# EAGLE design tick-mk-5.0.1 (EAGLE 6.5.0)
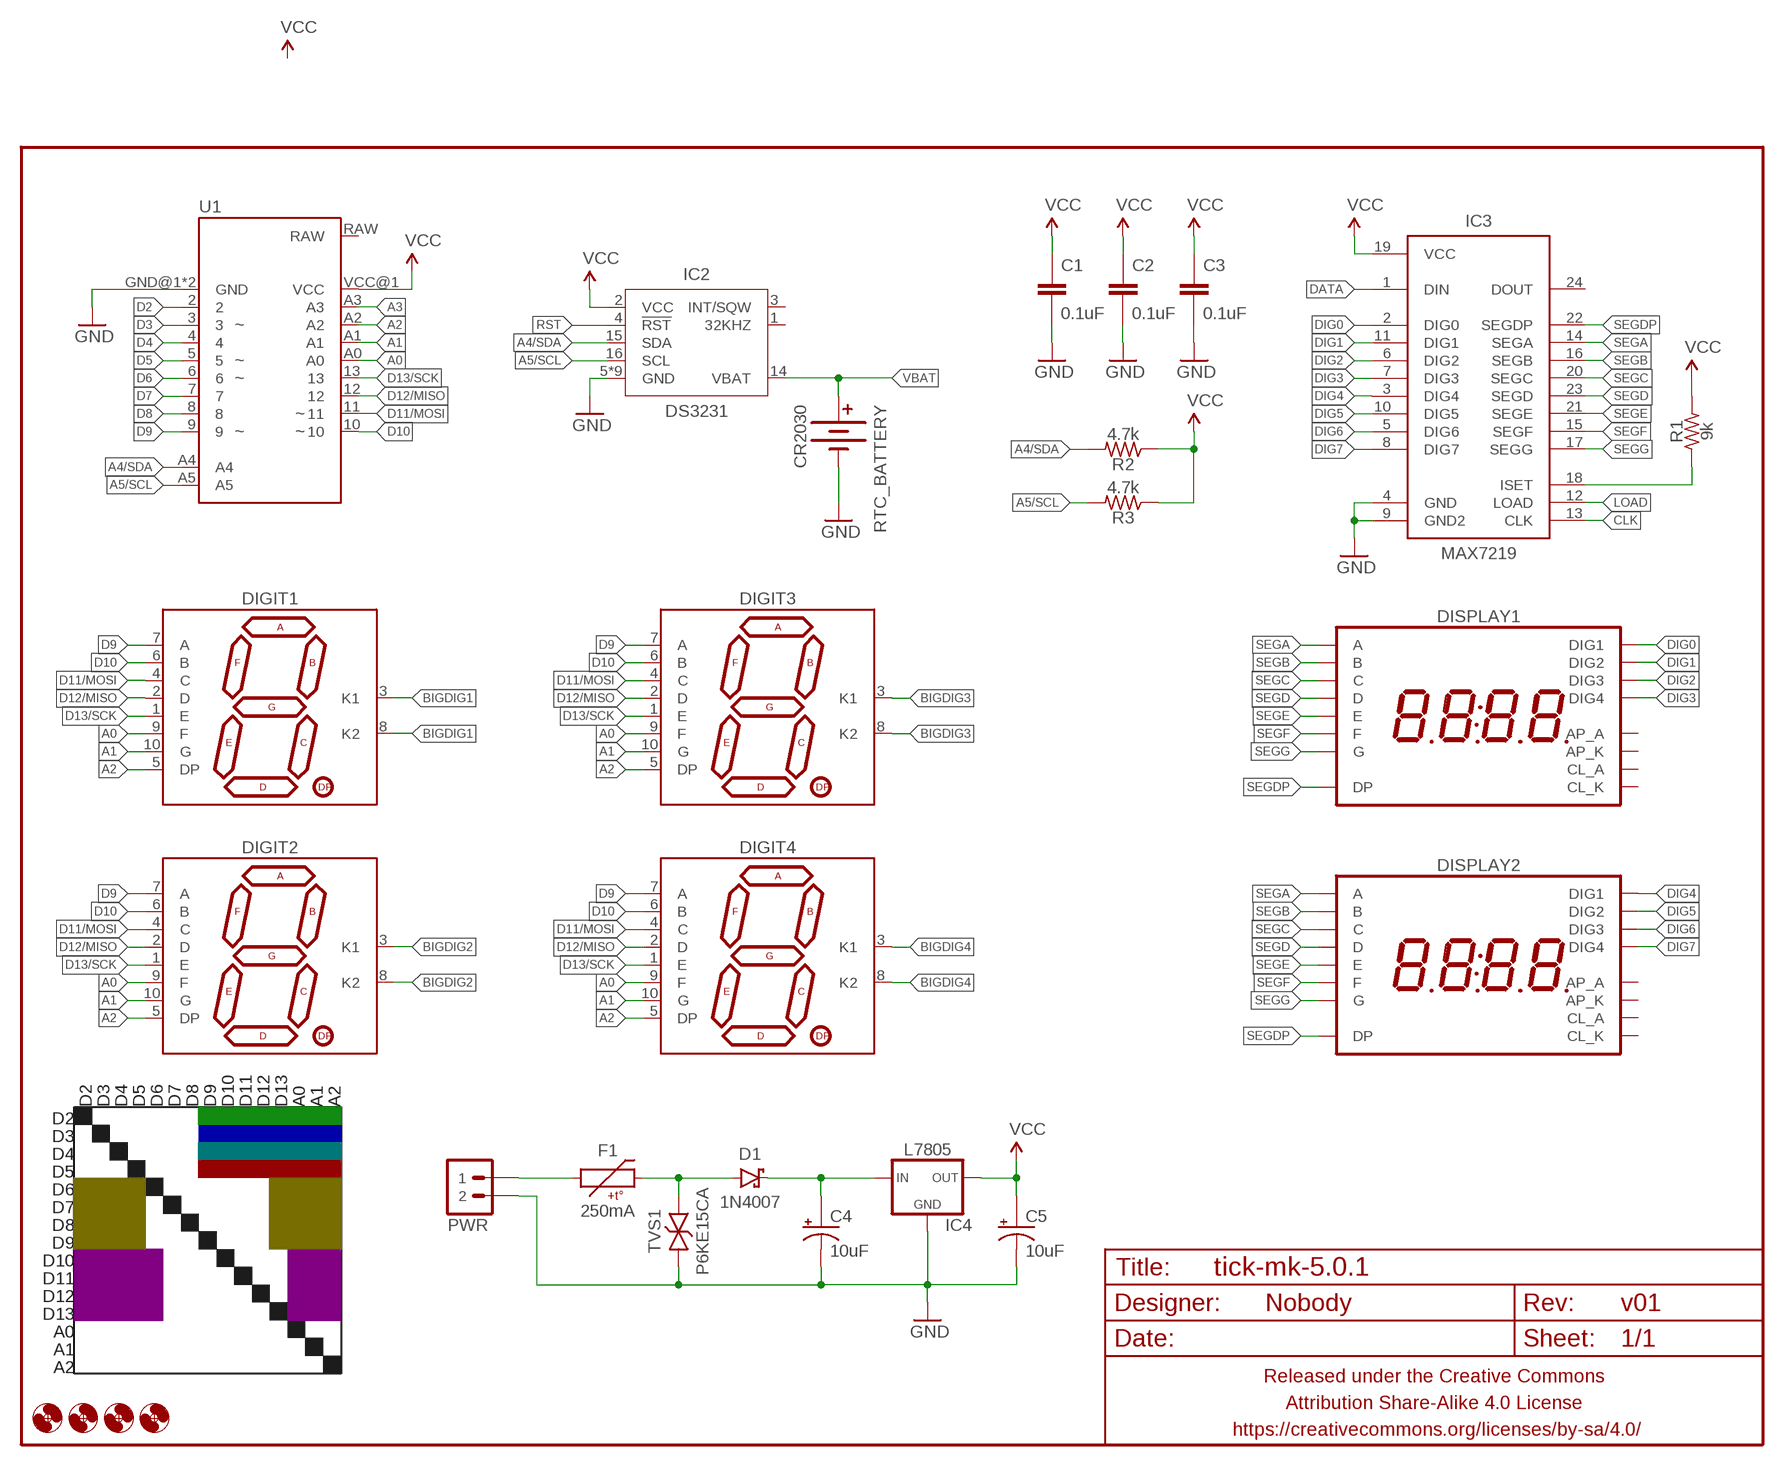
[diagram p0: schematic, sheet 1]

## Parts
C1  0.1uF  CAPACITOR-CERAMIC025-024X044  [C025-024X044]
C2  0.1uF  CAPACITOR-CERAMIC025-024X044  [C025-024X044]
C3  0.1uF  CAPACITOR-CERAMICC0603  [C0603]
C4  10uF  CAPACITOR-POLARIZEDE2-5  [E2-5]
C5  10uF  CAPACITOR-POLARIZEDE2-5  [E2-5]
D1  1N4007  DIODE-SCHOTTKYPTH-10.16MM  [DIODE-10.16MM]
DIGIT1  7SEG_1DIGPTH-25.4MM-BARE  [7SEG_1DIG_25.4MM_NOSILK]
DIGIT2  7SEG_1DIGPTH-25.4MM-BARE  [7SEG_1DIG_25.4MM_NOSILK]
DIGIT3  7SEG_1DIGPTH-25.4MM-BARE  [7SEG_1DIG_25.4MM_NOSILK]
DIGIT4  7SEG_1DIGPTH-25.4MM-BARE  [7SEG_1DIG_25.4MM_NOSILK]
DISPLAY1  7SEG_4DIGIT_COLON_APOS  [7SEG_4DIG_10MM]
DISPLAY2  7SEG_4DIGIT_COLON_APOS  [7SEG_4DIG_10MM]
F1  250mA  PTCPTH-5.08MM  [PTC-PTH-5.08MM]
FRAME1  FRAME-LETTERNO_PACKAGE  [DUMMY]
H1  HOLE2,5  [2,5]
H2  HOLE2,5  [2,5]
H3  HOLE2,5  [2,5]
H4  HOLE2,5  [2,5]
IC2  DS3231  [SO16W]
IC3  MAX7219  MAX7219SOIC-W  [SO24W]
IC4  L7805  V_REG_78XXTO-220-THERMPAD  [TO220-IGO-THERMPAD]
PWR  M02JST-PTH-RA-L+  [JST-2-PH-RA-PTH-L+]
R1  9k  RESISTORR0603  [R0603]
R2  4.7k  RESISTORPTH-AXIAL-6.35MM  [RESISTOR-AXIAL-PTH-6.35MM]
R3  4.7k  RESISTORPTH-AXIAL-6.35MM  [RESISTOR-AXIAL-PTH-6.35MM]
RTC_BATTERY  CR2030  BATTERY20MM_SMD_TIGHT  [BATTCON_20MM_MINE_STAHPIT]
TVS1  P6KE15CA  TVSDO-41-10.16MM  [DO-41-TVS-BI-10.16MM]
U1  ARDUINO_PRO_MINI_TICK2  [ARDUINO_PRO_MINI_TICK2]

## Nets
A0: DIGIT1.9(F) DIGIT2.9(F) DIGIT3.9(F) DIGIT4.9(F) U1.A0
A1: DIGIT1.10(G) DIGIT2.10(G) DIGIT3.10(G) DIGIT4.10(G) U1.A1
A2: DIGIT1.5(DP) DIGIT2.5(DP) DIGIT3.5(DP) DIGIT4.5(DP) U1.A2
A3: U1.A3
A4/SDA: IC2.15(SDA) R2.P$2 U1.A4
A5/SCL: IC2.16(SCL) R3.P$2 U1.A5
BIGDIG1: DIGIT1.3(K1) DIGIT1.8(K2)
BIGDIG2: DIGIT2.3(K1) DIGIT2.8(K2)
BIGDIG3: DIGIT3.3(K1) DIGIT3.8(K2)
BIGDIG4: DIGIT4.3(K1) DIGIT4.8(K2)
CLK: IC3.13(CLK)
D2: U1.2
D3: U1.3
D4: U1.4
D5: U1.5
D6: U1.6
D7: U1.7
D8: U1.8
D9: DIGIT1.7(A) DIGIT2.7(A) DIGIT3.7(A) DIGIT4.7(A) U1.9
D10: DIGIT1.6(B) DIGIT2.6(B) DIGIT3.6(B) DIGIT4.6(B) U1.10
D11/MOSI: DIGIT1.4(C) DIGIT2.4(C) DIGIT3.4(C) DIGIT4.4(C) U1.11
D12/MISO: DIGIT1.2(D) DIGIT2.2(D) DIGIT3.2(D) DIGIT4.2(D) U1.12
D13/SCK: DIGIT1.1(E) DIGIT2.1(E) DIGIT3.1(E) DIGIT4.1(E) U1.13
DATA: IC3.1(DIN)
DIG0: DISPLAY1.1(DIG1) IC3.2(DIG0)
DIG1: DISPLAY1.2(DIG2) IC3.11(DIG1)
DIG2: DISPLAY1.6(DIG3) IC3.6(DIG2)
DIG3: DISPLAY1.8(DIG4) IC3.7(DIG3)
DIG4: DISPLAY2.1(DIG1) IC3.3(DIG4)
DIG5: DISPLAY2.2(DIG2) IC3.10(DIG5)
DIG6: DISPLAY2.6(DIG3) IC3.5(DIG6)
DIG7: DISPLAY2.8(DIG4) IC3.8(DIG7)
GND: C1.2 C2.2 C3.2 C4.- C5.- IC2.5(GND) IC2.6(GND) IC2.7(GND) IC2.8(GND) IC2.9(GND) IC2.10(GND) IC2.11(GND) IC2.12(GND) IC2.13(GND) IC3.4(GND) IC3.9(GND2) IC4.4(GND) IC4.GND PWR.2 RTC_BATTERY.BOTTOM(-) TVS1.P$1 U1.GND@1(GND) U1.GND@2(GND)
LOAD: IC3.12(LOAD)
N$4: D1.A F1.P$2 TVS1.P$2
N$5: IC3.18(ISET) R1.1
N$7: F1.P$1 PWR.1
N$8: C4.+ D1.C IC4.IN
RST: IC2.4(!RST)
SEGA: DISPLAY1.14(A) DISPLAY2.14(A) IC3.14(SEGA)
SEGB: DISPLAY1.16(B) DISPLAY2.16(B) IC3.16(SEGB)
SEGC: DISPLAY1.13(C) DISPLAY2.13(C) IC3.20(SEGC)
SEGD: DISPLAY1.3(D) DISPLAY2.3(D) IC3.23(SEGD)
SEGDP: DISPLAY1.7(DP) DISPLAY2.7(DP) IC3.22(SEGDP)
SEGE: DISPLAY1.5(E) DISPLAY2.5(E) IC3.21(SEGE)
SEGF: DISPLAY1.11(F) DISPLAY2.11(F) IC3.15(SEGF)
SEGG: DISPLAY1.15(G) DISPLAY2.15(G) IC3.17(SEGG)
VBAT: IC2.14(VBAT) RTC_BATTERY.TOP@1(+) RTC_BATTERY.TOP@2(+)
VCC: C1.1 C2.1 C3.1 C5.+ IC2.2(VCC) IC3.19(VCC) IC4.OUT R1.2 R2.P$1 R3.P$1 U1.VCC@1(VCC)
Unconnected: DISPLAY1.4(CL_A) DISPLAY1.9(AP_K) DISPLAY1.10(AP_A) DISPLAY1.12(CL_K) DISPLAY2.4(CL_A) DISPLAY2.9(AP_K) DISPLAY2.10(AP_A) DISPLAY2.12(CL_K) IC2.1(32KHZ) IC2.3(INT/SQW) IC3.24(DOUT) U1.RAW

## Notes on the sheet
- D2 | D3 | D4 | D5 | D6 | D7 | D8 | D9 | D10 | D11 | D12 | D13 | A0 | A1 | A2
- D2
- D3
- D4
- D5
- D6
- D7
- D8
- D9
- D10
- D11
- D12
- D13
- A0
- A1
- A2

## Library data of the parts
C1-C3 = A_butts:CAPACITOR-CERAMIC: CAPACITOR, European symbol
C4 C5 = A_butts:CAPACITOR-POLARIZED: POLARIZED CAPACITOR, American symbol
D1 = A_butts:DIODE-SCHOTTKY: Schottky diodes in SFE's production catalog BAT20J 1A 23V 0.62Vf RB751 120mA 40V 0.37Vf PMEG4005EJ 0.5A 40V 0.42Vf MBRA140 1A 40V 0.5Vf B340A 3A 40V SMA
DIGIT1-DIGIT4 = A_butts:7SEG_1DIG
DISPLAY1 DISPLAY2 = A_butts:7SEG_4DIGIT_COLON_APOS
F1 = A_butts:PTC: Resettable Fuse PTC Resettable Fuse. Spark Fun Electronics SKU : COM-08357
FRAME1 = A_butts:FRAME-LETTER: Schematic Frame Standard 8.5x11 US Letter frame; DESIGNER: Nobody; VERSION: v01
H1-H4 = A_butts:HOLE: MOUNTING HOLE with drill center marker
IC2 = A_butts:DS3231
IC3 = A_butts:MAX7219: 8-digit, 8-segment LED display driver, serial input
IC4 = A_butts:V_REG_78XX: Voltage Regulator Standard 7805 5V regulator. IGO (Input Ground Output). Spark Fun Electronics SKU : COM-00107
PWR = A_butts:M02: Standard 2-pin 0.1" header. Use with - straight break away headers ( PRT-00116) - right angle break away headers (PRT-00553) - swiss pins (PRT-00743) - machine pins (PRT-00117) - female headers (PRT-00115) Molex polarized connector foot print use with: PRT-08233 with associated crimp pins and housings. 2.54_SCREWTERM for use with PRT-10571. 3.5mm Screw Terminal footprints for PRT-08084 5mm Screw Terminal footprints for use with PRT-08433
R1-R3 = A_butts:RESISTOR: RESISTOR, American symbol
RTC_BATTERY = A_butts:BATTERY: Battery Holders Various common sizes : AA, AAA, 20mm coin cell and 12mm coin cell. 20MM_4LEGS, BATT-10373
TVS1 = A_butts:TVS: Transient voltage suppressor- prevents ESD on inputs. Ignore package description- MBRA140 is NOT this type of part!!!
U1 = A_butts:ARDUINO_PRO_MINI_TICK2

## Board
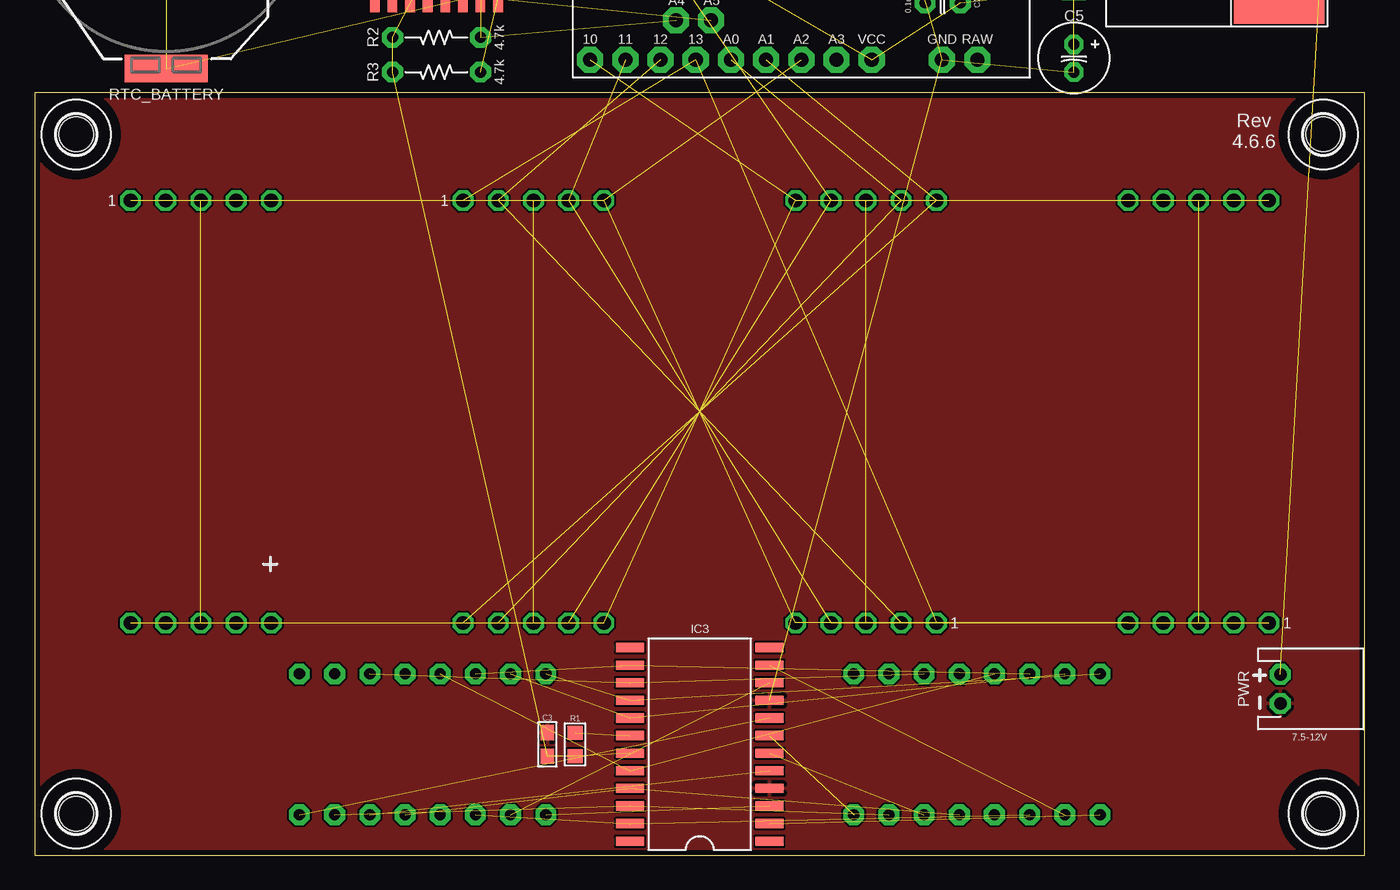
[diagram p1: board, top side]
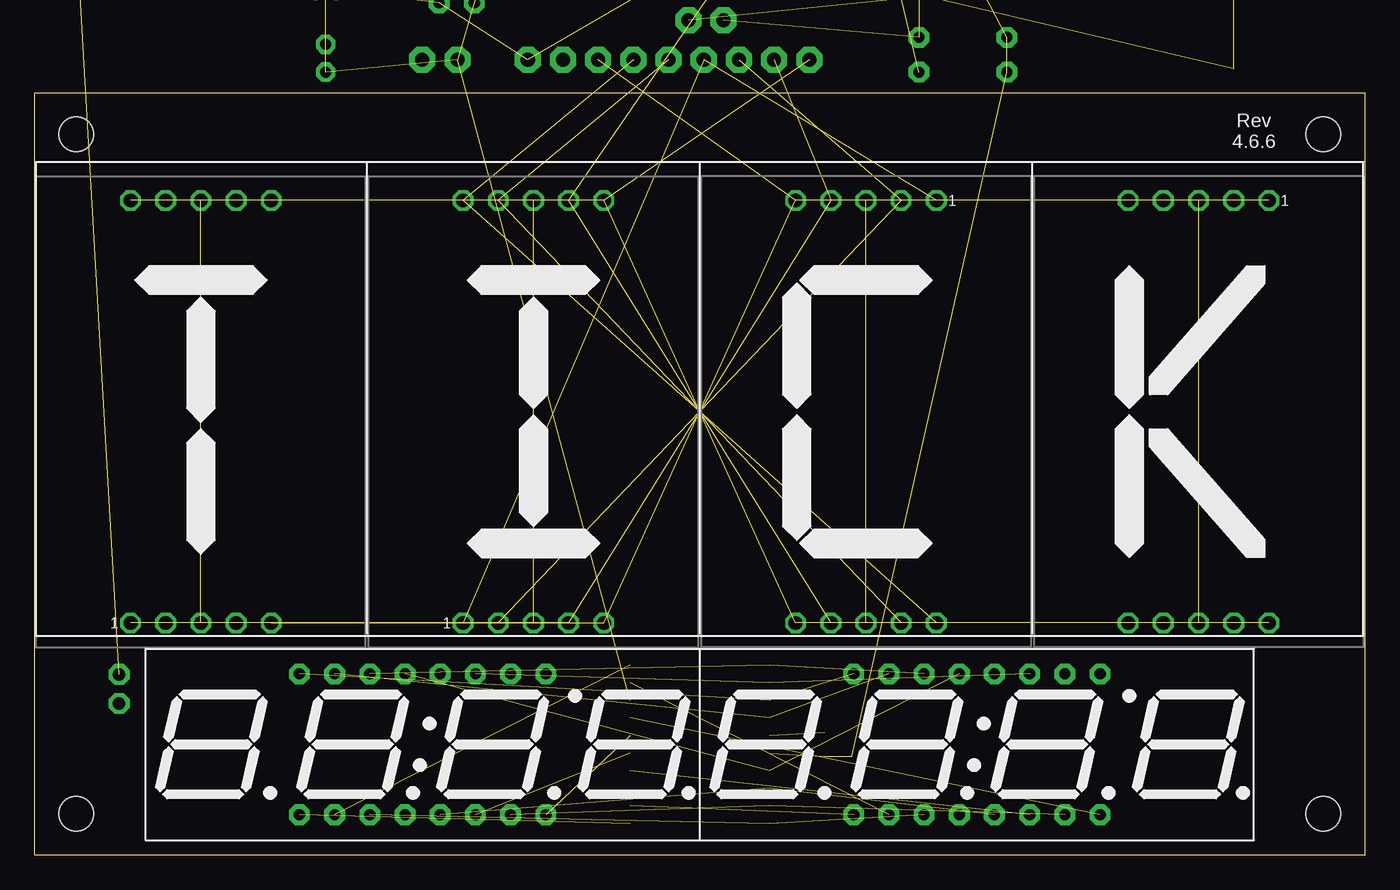
[diagram p2: board, bottom side, seen from below]

Size 96 x 55 mm. Coordinates in mm from the lower left corner, seen from the top.
Outline: 0,55 0,0 96,0 96,55 0,55
Copper layers (1*16): Top 0.0356mm / dielectric 1.5011mm / Bottom 0.0356mm
Design rules "LaenPCBOrder_2": minimum track width 6mil, minimum drill 13mil, track to track 6mil, track to pad 6mil, pad to pad 6mil, via to via 6mil, smd to smd 6mil, copper to edge 15mil, drill to drill 6mil, minimum pad ring 7mil, minimum via ring 7mil, stop-mask expansion 3mil, vias tented up to drill 20mil, thermal gap 10mil

### Footprints (pad centres in the part's own frame; a part is rotated, then mirrored left to right if it is on the bottom)
C025-024X044 = drill 0.813 pad 1.5 octagon: 1 -1.27,0; 2 1.27,0
C0603 = smd 1.1 x 1: 1 -0.85,0; 2 0.85,0
E2-5 = drill 0.8 pad 1.4 octagon: + -1,0; - 1,0
DIODE-10.16MM = drill 1.1 pad 1.778: A -5.08,0; C 5.08,0
7SEG_1DIG_25.4MM_NOSILK = drill 1 pad 1.5 octagon: 1 -5.08,-15.24; 2 -2.54,-15.24; 3 0,-15.24; 4 2.54,-15.24; 5 5.08,-15.24; 6 5.08,15.24; 7 2.54,15.24; 8 0,15.24; 9 -2.54,15.24; 10 -5.08,15.24
7SEG_4DIG_10MM = drill 0.8 pad 1.5 octagon: 1 -8.89,-5.08; 2 -6.35,-5.08; 3 -3.81,-5.08; 4 -1.27,-5.08; 5 1.27,-5.08; 6 3.81,-5.08; 7 6.35,-5.08; 8 8.89,-5.08; 9 8.89,5.08; 10 6.35,5.08; 11 3.81,5.08; 12 1.27,5.08; 13 -1.27,5.08; 14 -3.81,5.08; 15 -6.35,5.08; 16 -8.89,5.08
PTC-PTH-5.08MM = drill 0.9 pad 1.5 octagon: P$1 -2.54,0; P$2 2.54,0
2,5 = hole 2.5: 0,0
SO16W = smd 0.7 x 2: 1 -4.445,-4.685; 2 -3.175,-4.685; 3 -1.905,-4.685; 4 -0.635,-4.685; 5 0.635,-4.685; 6 1.905,-4.685; 7 3.175,-4.685; 8 4.445,-4.685; 9 4.445,4.685; 10 3.175,4.685; 11 1.905,4.685; 12 0.635,4.685; 13 -0.635,4.685; 14 -1.905,4.685; 15 -3.175,4.685; 16 -4.445,4.685
SO24W = smd 0.66 x 2.032: 1 -6.985,-5.029; 2 -5.715,-5.029; 3 -4.445,-5.029; 4 -3.175,-5.029; 5 -1.905,-5.029; 6 -0.635,-5.029; 7 0.635,-5.029; 8 1.905,-5.029; 9 3.175,-5.029; 10 4.445,-5.029; 11 5.715,-5.029; 12 6.985,-5.029; 13 6.985,5.029; 14 5.715,5.029; 15 4.445,5.029; 16 3.175,5.029; 17 1.905,5.029; 18 0.635,5.029; 19 -0.635,5.029; 20 -1.905,5.029; 21 -3.175,5.029; 22 -4.445,5.029; 23 -5.715,5.029; 24 -6.985,5.029
TO220-IGO-THERMPAD = smd 10 x 6.5: 4 0,11 | drill 1 long: GND 0,-3.81; IN -2.54,-3.81; OUT 2.54,-3.81
JST-2-PH-RA-PTH-L+ = drill 0.9 pad 1.5 octagon: 1 -1.05,0; 2 1.05,0
R0603 = smd 1 x 1.1: 1 -0.85,0; 2 0.85,0
RESISTOR-AXIAL-PTH-6.35MM = drill 0.8 pad 1.5 octagon: P$1 -3.175,0; P$2 3.175,0
BATTCON_20MM_MINE_STAHPIT = smd 10 x 10: BOTTOM 0,0 | smd 6 x 2: TOP@1 0,11.25; TOP@2 0,-11.25
DO-41-TVS-BI-10.16MM = drill 1.1 pad 1.778: P$1 -5.08,0; P$2 5.08,0
ARDUINO_PRO_MINI_TICK2 = drill 1.016 pad 1.88 octagon: 2 -7.62,2.54; 3 -7.62,0; 4 -7.62,-2.54; 5 -7.62,-5.08; 6 -7.62,-7.62; 7 -7.62,-10.16; 8 -7.62,-12.7; 9 -7.62,-15.24; 10 7.62,-15.24; 11 7.62,-12.7; 12 7.62,-10.16; 13 7.62,-7.62; A0 7.62,-5.08; A1 7.62,-2.54; A2 7.62,0; A3 7.62,2.54; A4 4.763,-9.049; A5 4.763,-6.509; GND@1 -7.62,5.08; GND@2 7.62,10.16; RAW 7.62,12.7; VCC@1 7.62,5.08

### Placement (x,y rotation side)
C1  65.54,61.5 180 top  (outside the outline)
C2  36.5,70 270 top  (outside the outline)
C3  37,8 90 top
C4  75,72.5 90 top  (outside the outline)
C5  75,57.5 270 top
D1  84,76 180 top  (outside the outline)
DIGIT1  84,32 0 bottom
DIGIT2  60,32 0 bottom
DIGIT3  36,32 180 bottom
DIGIT4  12,32 180 bottom
DISPLAY1  68,8 0 bottom
DISPLAY2  28,8 0 bottom
F1  93.5,78.5 90 top  (outside the outline)
FRAME1  0,-13 0 top  (outside the outline)
H1  3,3 0 top
H2  93,3 0 top
H3  93,52 0 top
H4  3,52 0 top
IC2  29,66.5 180 top  (outside the outline)
IC3  48,8 90 top
IC4  78.81,65 270 top  (outside the outline)
PWR  89.9,12 270 top
R1  39,8 270 top
R2  29,59 0 top  (outside the outline)
R3  29,56.5 0 top
RTC_BATTERY  9.5,68 180 top
TVS1  84,81 0 top  (outside the outline)
U1  55.33,65 270 top
U$1  [TICK_SYMBOL]  48,32 0 bottom

### Tracks (layer width: path | path; a pad name or v marks a point on that pad's centre or on a via)
A0  (4 unrouted)
A1  (4 unrouted)
A2  (4 unrouted)
A4/SDA  (2 unrouted)
A5/SCL  (2 unrouted)
BIGDIG1  (1 unrouted)
BIGDIG2  (1 unrouted)
BIGDIG3  (1 unrouted)
BIGDIG4  (1 unrouted)
D9  (4 unrouted)
D10  (4 unrouted)
D11/MOSI  (4 unrouted)
D12/MISO  (4 unrouted)
D13/SCK  (4 unrouted)
DIG0  (1 unrouted)
DIG1  (1 unrouted)
DIG2  (1 unrouted)
DIG3  (1 unrouted)
DIG4  (1 unrouted)
DIG5  (1 unrouted)
DIG6  (1 unrouted)
DIG7  (1 unrouted)
GND  (19 unrouted)
  pour Top: -0.1,-0.1 96.1,-0.1 96.1,55.1 -0.1,55.1
N$4  (2 unrouted)
N$5  (1 unrouted)
N$7  (1 unrouted)
N$8  (2 unrouted)
SEGA  (2 unrouted)
SEGB  (2 unrouted)
SEGC  (2 unrouted)
SEGD  (2 unrouted)
SEGDP  (2 unrouted)
SEGE  (2 unrouted)
SEGF  (2 unrouted)
SEGG  (2 unrouted)
VBAT  (2 unrouted)
VCC  (10 unrouted)

### Text on the board
tPlace: Rev | 7.5-12V
bPlace: Rev